# EAGLE design power.rev.3.3 (EAGLE 7.5.0)
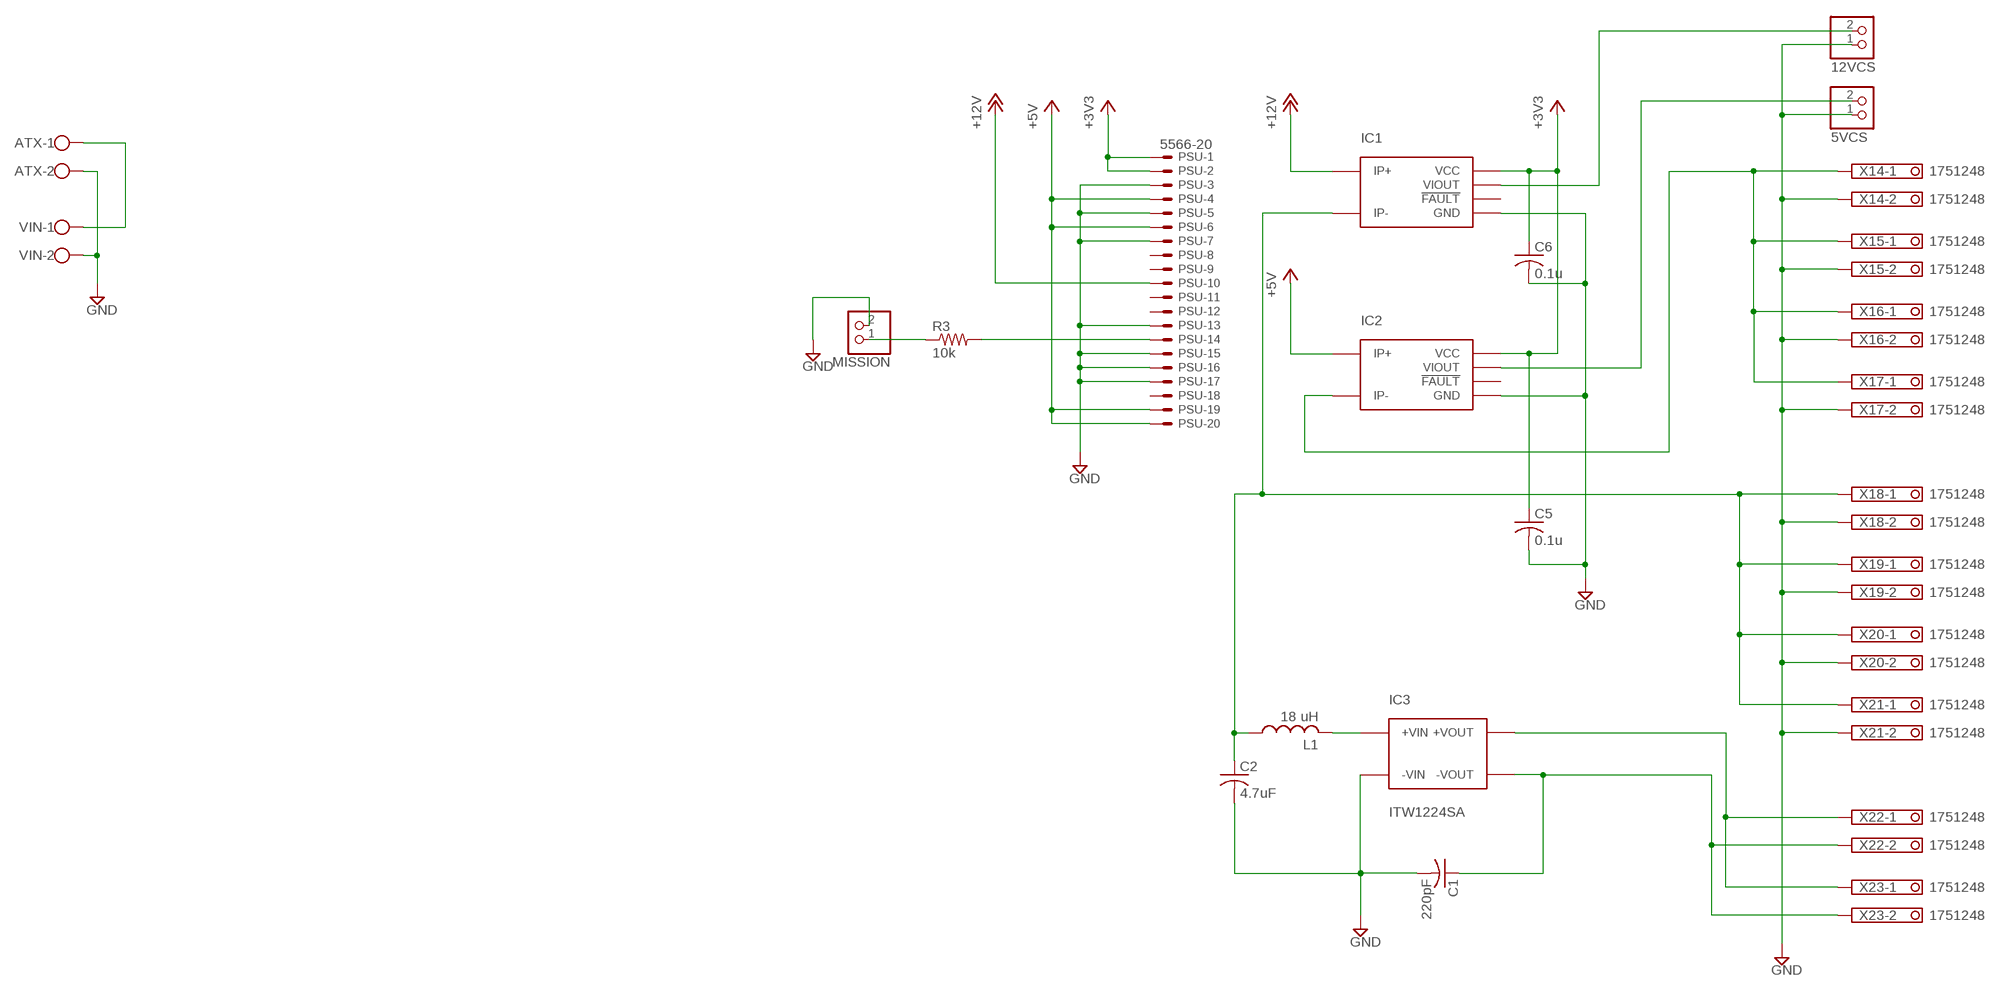
[diagram p0: schematic, sheet 1]

## Parts
5VCS  PINHD-1X2  [1X02]
12VCS  PINHD-1X2  [1X02]
ATX  W237-102  [W237-102]
C1  220pF  C-USC1206  [C1206]
C2  4.7uF  C-USC1206  [C1206]
C5  0.1u  C-USC0805  [C0805]
C6  0.1u  C-USC0805  [C0805]
IC1  ACS711  [12-WFQFN]
IC2  ACS711  [12-WFQFN]
IC3  ITW1224SA  [6-SIP]
L1  18 uH  L-USL2825P  [L2825P]
MISSION  PINHD-1X2  [1X02]
PSU  5566-20  [5566-20]
R3  10k  R-US_R0805  [R0805]
VIN  W237-102  [W237-102]
X14  1751248  [1751248]
X15  1751248  [1751248]
X16  1751248  [1751248]
X17  1751248  [1751248]
X18  1751248  [1751248]
X19  1751248  [1751248]
X20  1751248  [1751248]
X21  1751248  [1751248]
X22  1751248  [1751248]
X23  1751248  [1751248]

## Nets
+3V3: C5.1 C6.1 IC1.P$10(VCC) IC2.P$10(VCC) PSU.1 PSU.2
+5V: IC2.P$1(IP+) PSU.4 PSU.6 PSU.19 PSU.20
+12V: IC1.P$1(IP+) PSU.10
GND: 5VCS.1 12VCS.1 ATX.2 C1.2 C2.2 C5.2 C6.2 IC1.P$3(GND) IC2.P$3(GND) IC3.P$1(-VIN) MISSION.2 PSU.3 PSU.5 PSU.7 PSU.13 PSU.15 PSU.16 PSU.17 VIN.2 X14.2 X15.2 X16.2 X17.2 X18.2 X19.2 X20.2 X21.2
N$1: IC3.P$3(+VOUT) X22.1 X23.1
N$2: C1.1 IC3.P$5(-VOUT) X22.2 X23.2
N$3: IC3.P$2(+VIN) L1.2
N$4: ATX.1 VIN.1
N$5: PSU.14 R3.2
N$6: MISSION.1 R3.1
N$11: C2.1 IC1.P$2(IP-) L1.1 X18.1 X19.1 X20.1 X21.1
N$13: IC2.P$2(IP-) X14.1 X15.1 X16.1 X17.1
N$14: 12VCS.2 IC1.P$9(VIOUT)
N$15: 5VCS.2 IC2.P$9(VIOUT)
Unconnected: IC1.P$4(!FAULT) IC2.P$4(!FAULT) PSU.8 PSU.9 PSU.11 PSU.12 PSU.18

## Library data of the parts
5VCS 12VCS MISSION = pinhead:PINHD-1X2: PIN HEADER
ATX VIN = con-wago-500:W237-102: WAGO SCREW CLAMP; MPN: 237-102; OC_FARNELL: unknown; OC_NEWARK: 70K9898
C1 C2 = resistor:C-US: CAPACITOR, American symbol
C5 C6 = rcl:C-US: CAPACITOR, American symbol
IC1 IC2 = zonapowerbrd:ACS711
IC3 = zonapowerbrd:ITW1224SA
L1 = resistor:L-US: INDUCTOR, American symbol
PSU = con-molex:5566-20: Mini FIT connector 20 pol ATX PC-Motherboard Power connector Source: http://www.molex.com; OC_FARNELL: unknown; OC_NEWARK: unknown
R3 = resistor:R-US_: RESISTOR, American symbol
X14-X23 = con-phoenix-350:1751248: MKDS 1/ 2-3,5 Printklemme Nennstrom: 10 A Bemessungsspannung: 160 V Raster: 3,5 mm Polzahl: 2 Montageart: Löten Anschlussart: Schraubanschluss Anschlussrichtung vom Leiter zur Platine: 0° Source: http://eshop.phoenixcontact.com .. 1751248.pdf; OC_FARNELL: unknown; OC_NEWARK: unknown

## Board
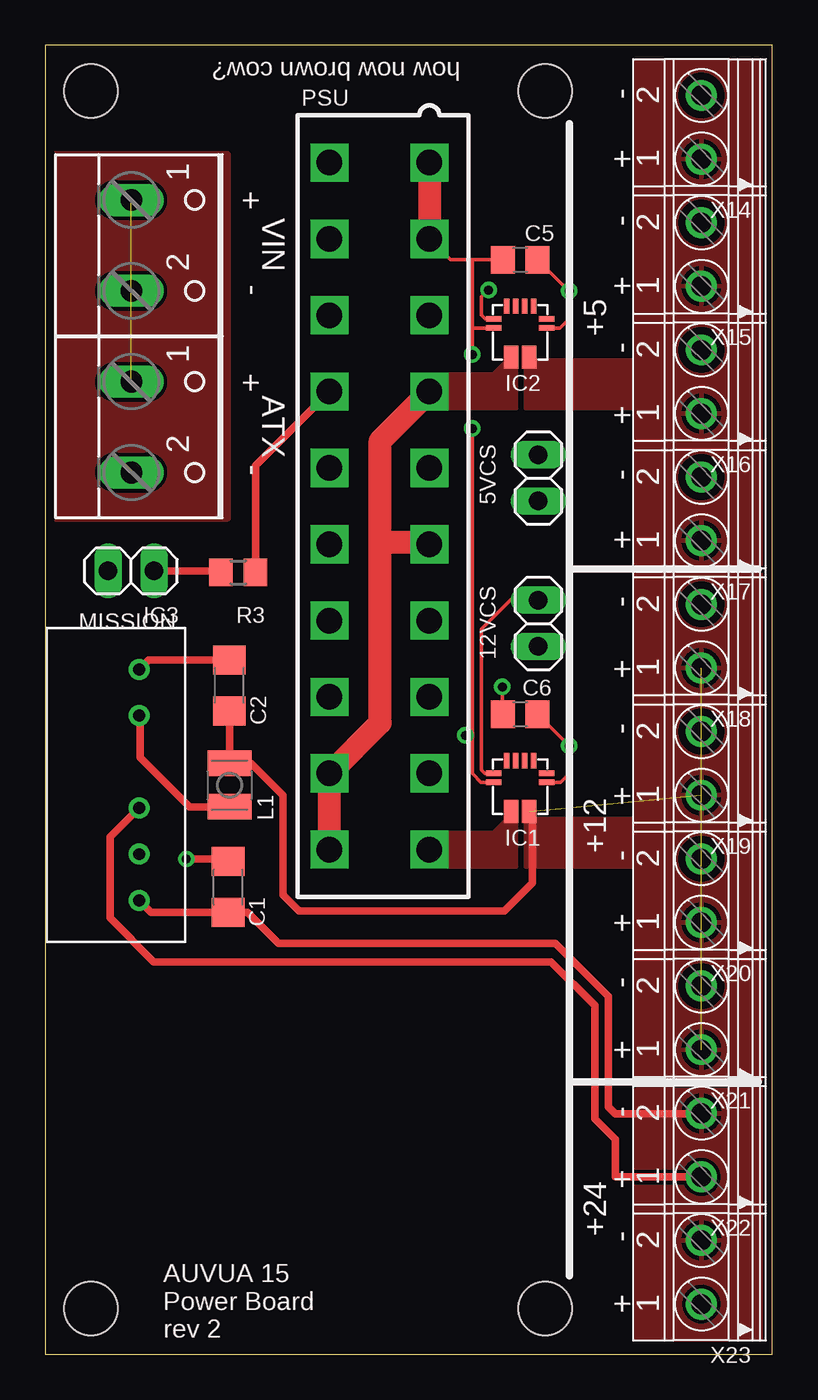
[diagram p1: board, top side]
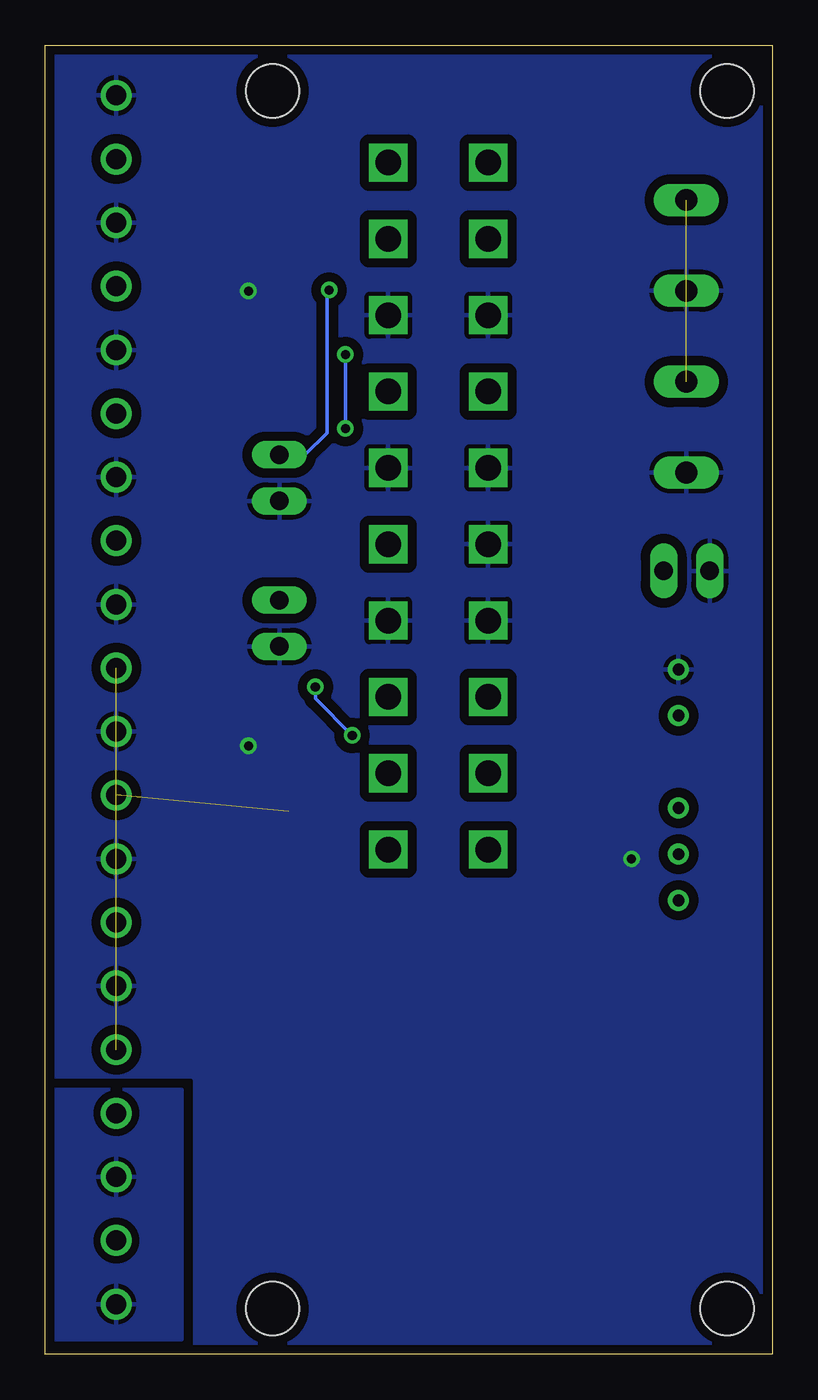
[diagram p2: board, bottom side, seen from below]

Size 40 x 72 mm. Coordinates in mm from the lower left corner, seen from the top.
Outline: 0,0 40,0 40,72 0,72 0,0
Copper layers (1*16): Top 0.035mm / dielectric 1.5mm / Bottom 0.035mm
Design rules "default *": minimum track width 8mil, minimum drill 20mil, track to track 8mil, track to pad 8mil, pad to pad 6mil, via to via 8mil, smd to smd 8mil, copper to edge 20mil, drill to drill 8mil, minimum pad ring 10mil, minimum via ring 8mil, stop-mask expansion 4mil, vias tented up to drill 0mil, thermal gap 10mil
Holes 2.95 mm at 2.5,2.5 2.5,69.5 27.5,69.5 27.5,2.5

### Footprints (pad centres in the part's own frame; a part is rotated, then mirrored left to right if it is on the bottom)
1X02 = drill 1.016 long: 1 -1.27,0; 2 1.27,0
W237-102 = drill 1.194 long: 1 -2.5,-1.27; 2 2.5,-1.27
C1206 = smd 1.6 x 1.8: 1 -1.4,0; 2 1.4,0
C0805 = smd 1.3 x 1.5: 1 -0.95,0; 2 0.95,0
12-WFQFN = smd 1.27 x 0.8: P$1 -1.35,0.5; P$2 -1.35,-0.5 | smd 0.3 x 0.85: P$3 0.25,-1.45; P$4 0.75,-1.45; P$9 0.75,1.45; P$10 0.25,1.45 | smd 0.85 x 0.3: P$5 1.45,-0.75; P$6 1.45,-0.25; P$7 1.45,0.25; P$8 1.45,0.75
6-SIP = drill 0.65: P$1 -6.35,0; P$2 -3.81,0; P$3 1.27,0; P$4 3.81,0; P$5 6.35,0
L2825P = smd 1.4 x 2.4: 1 -1.2,0; 2 1.2,0
5566-20 = drill 1.4 square: 1 18.9,-2.75; 2 14.7,-2.75; 3 10.5,-2.75; 4 6.3,-2.75; 5 2.1,-2.75; 6 -2.1,-2.75; 7 -6.3,-2.75; 8 -10.5,-2.75; 9 -14.7,-2.75; 10 -18.9,-2.75; 11 18.9,2.75; 12 14.7,2.75; 13 10.5,2.75; 14 6.3,2.75; 15 2.1,2.75; 16 -2.1,2.75; 17 -6.3,2.75; 18 -10.5,2.75; 19 -14.7,2.75; 20 -18.9,2.75
R0805 = smd 1.3 x 1.5: 1 -0.95,0; 2 0.95,0
1751248 = drill 1.1 pad 1.7: 1 -1.75,-0.1; 2 1.75,-0.1

### Placement (x,y rotation side)
5VCS  27.13,48.21 90 top
12VCS  27.13,40.21 90 top
ATX  6,51 270 top
C1  10.05,25.7 90 top
C2  10.12,36.79 90 top
C5  26.13,60.21 0 top
C6  26.13,35.21 0 top
IC1  26.13,31.21 90 top
IC2  26.13,56.21 90 top
IC3  5.16,31.32 270 top
L1  10.13,31.3 270 top
MISSION  4.71,43.09 180 top
PSU  18.38,46.66 90 top
R3  10.61,43.01 0 top
VIN  6,61 270 top
X14  36,67.5 90 top
X15  36,60.5 90 top
X16  36,53.5 90 top
X17  36,46.5 90 top
X18  36,39.5 90 top
X19  36,32.5 90 top
X20  36,25.5 90 top
X21  36,18.5 90 top
X22  36,11.5 90 top
X23  36,4.5 90 top

### Tracks (layer width: path | path; a pad name or v marks a point on that pad's centre or on a via)
+3V3  (via drill 0.5)
  Top 0.203: IC1.P$10 23.98,31.46 23.5,31.94 23.5,34.04 | 21.13,60.89 PSU.2 22.28,60.21 23.5,60.21 | 23.5,34.04 v23.5,50.93 | 23.5,56.39 23.5,60.21 | v23.5,54.99 23.5,56.39 | 23.5,56.39 23.56,56.46 IC2.P$10 | C6.1 25.15,35.18 v25.15,36.7 | v23.11,34.04 23.5,34.04 | C5.1 23.5,60.21
  Top 1.27: PSU.1 PSU.2
  Bottom 0.203: v23.5,50.93 v23.5,54.99 | v25.15,36.7 25.15,36.07 v23.11,34.04
+5V
  Top 1.27: PSU.4 18.41,50.24 18.41,44.64 | PSU.20 PSU.19 18.41,34.74 18.41,44.64 | PSU.6 21.05,44.64 18.41,44.64
  pour Top (no thermals): 25.91,54.67 25.91,52.01 21.97,52.01 21.97,53.91 24.64,53.91 25.4,54.67
+12V
  pour Top (no thermals): 25.91,29.47 25.91,26.81 21.97,26.81 21.97,28.71 24.64,28.71 25.4,29.47
GND  (via drill 0.5)
  Top 0.203: C6.2 28.83,33.45 | 28.83,33.45 28.83,31.94 28.34,31.46 IC1.P$3 | C5.2 28.83,58.45 | 28.83,58.45 28.83,56.96 28.32,56.46 IC2.P$3 | 28.83,58.45 v28.83,58.48 | 28.83,33.45 v28.83,33.47
  Top 0.406: C1.2 9.92,27.1 9.78,27.24 v7.75,27.24 | C2.2 5.68,38.19 IC3.P$1
  pour Bottom (isolate 0.508, rank 2): 0,72 40,72 40,0 0,0
N$1
  Top 0.406: IC3.P$3 3.56,28.44 3.56,24 5.97,21.59 27.81,21.59 30.23,19.18 30.23,12.95 31.37,11.81 31.37,9.75 X22.1
  pour Bottom (isolate 0.406): 40.13,14.54 32.51,14.54 32.51,0.83 40.13,0.83
N$2
  Top 0.406: IC3.P$5 5.83,24.3 C1.1 11.14,24.3 12.83,22.61 28.07,22.61 30.99,19.68 30.99,13.59 31.37,13.21 36.06,13.21 X22.2
  pour Top: 32.51,14.54 40.13,14.54 40.13,0.83 32.51,0.83
N$3
  Top 0.406: L1.2 7.93,30.1 5.21,32.83 5.21,35.08 IC3.P$2
N$4  (1 unrouted)
N$5
  Top 0.406: R3.2 11.56,48.88 PSU.14
N$6
  Top 0.406: MISSION.1 9.58,43.09 R3.1
N$11  (4 unrouted)
  Top 0.406: C2.1 10.13,35.38 L1.1 11.31,32.5 13.08,30.73 13.08,25.27 13.97,24.38 25.27,24.38 26.8,25.91 26.8,29.69 IC1.P$2
  pour Top (isolate 0.406, rank 3): 40.13,42.99 32.51,42.99 32.51,15.05 40.13,15.05
  pour Top (no thermals): 26.42,29.47 32.77,29.47 32.77,26.81 26.42,26.81
N$13
  pour Top (isolate 0.406, rank 2): 40.13,71.18 32.51,71.18 32.51,43.5 40.13,43.5
  pour Top (no thermals): 26.42,54.67 32.77,54.67 32.77,52.01 26.42,52.01
N$14
  Top 0.203: 12VCS.2 25.6,41.48 24,39.88 24,32.13 24.18,31.96 IC1.P$9
N$15  (via drill 0.5)
  Top 0.203: IC2.P$9 24.2,56.96 24,57.15 24,58.17 v24.38,58.55
  Bottom 0.203: v24.38,58.55 24.38,58.42 24.51,58.29 24.51,50.67 25.71,49.48 5VCS.2
N$17
  pour Top: 0,66 10,66 10,46 0,46

### Text on the board
tNames: how now brown cow? | - | + | + | - | - | + | +5 | - | + | + | - | - | + | - | + | - | + | +12 | - | + | - | + | - | + | +24 | - | AUVUA 15 / Power Board / rev 2 | +